# Altium schematic sheet OBPeripheral.SchDoc: ZoM Mod A - OnBoard Peripherals
size A4; Organization: Trenz Electronic GmbH; DocumentNumber: 4; Revision: 01; SheetNumber: 4; SheetTotal: 13; Date: 12/16/2014
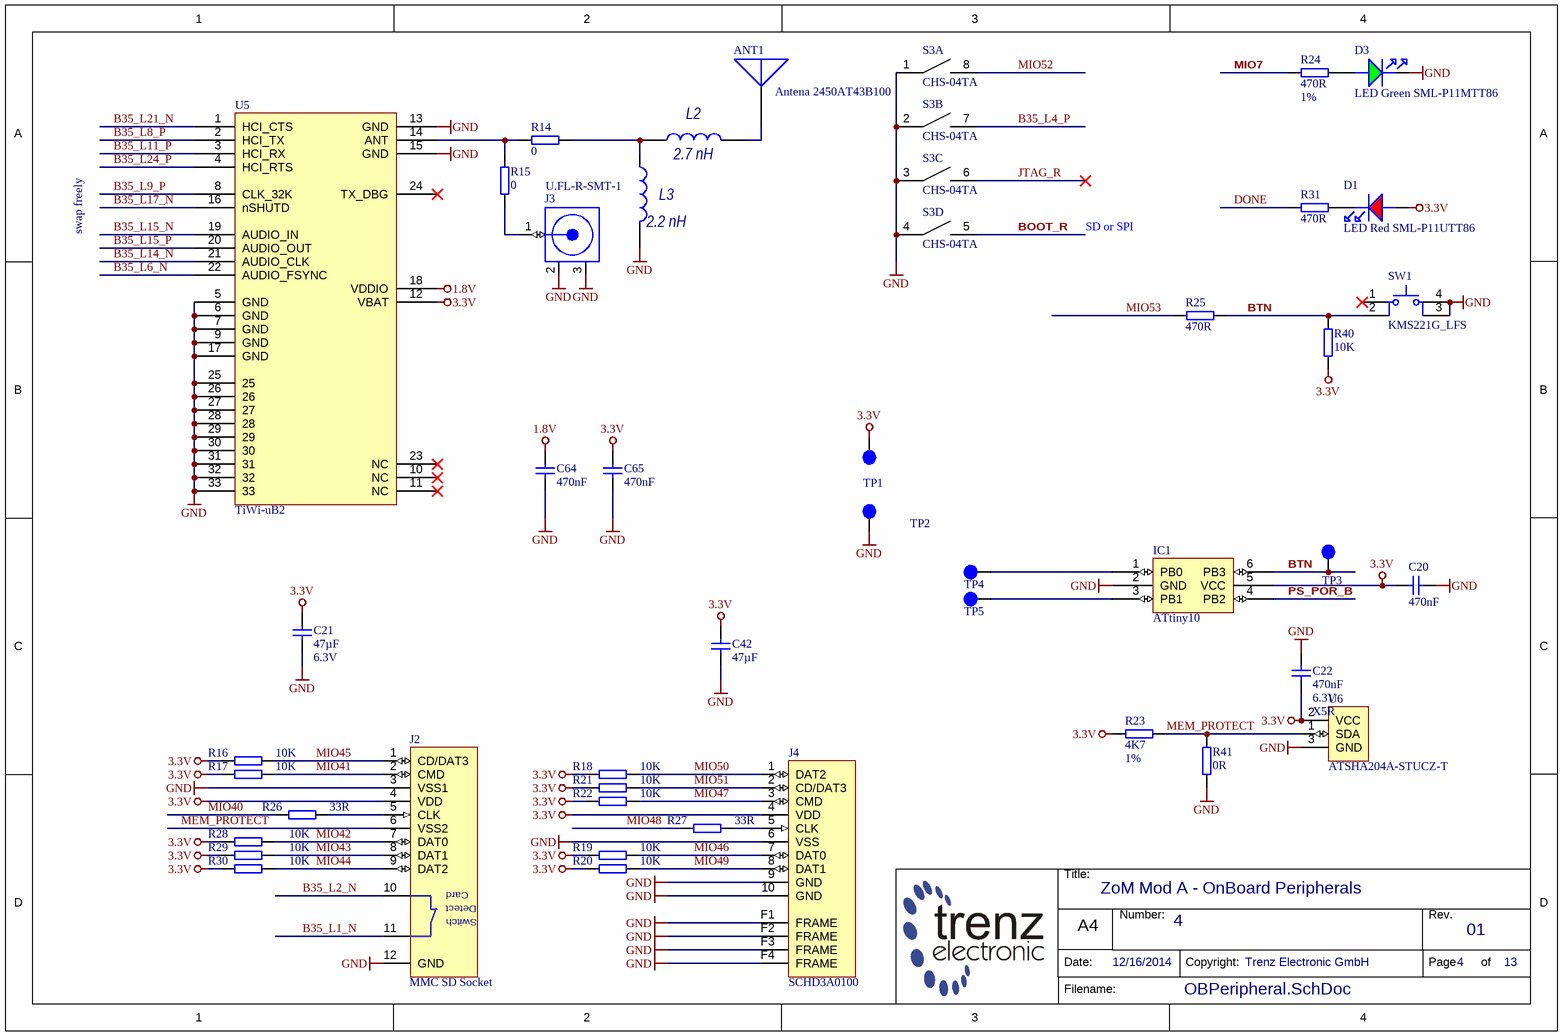
[diagram p0: OBPeripheral.SchDoc]

## Parts
ANT1  Antena 2450AT43B100  [Antena 2450AT43B100]
C20  470nF  [CAPC0603X33N]
C21  47µF  Voltage: 6.3V  [CAPC3216X180N]
C22  470nF  Voltage: 6.3V  Technology: X5R  [CAPC0603X33N]
C42  47µF  [CAPC3216X180N]
C64  470nF  [CAPC0603X33N]
C65  470nF  [CAPC0603X33N]
D1  LED Red SML-P11UTT86  [LEDC1006X25N_RED]
D3  LED Green SML-P11MTT86  [LEDC1006X25N_GREEN]
IC1  value ATtiny10  [SOT23-6]  (hidden comment: Atmel AVR ATtiny10)
J2  MMC SD Socket  [104C-TAA0-R]
J3  U.FL-R-SMT-1  [U.FL-R-SMT-1]
J4  SCHD3A0100  [SCHD3A0100]
L2  US_VisibleSCH: 2.7 nH  [RESC1005X40R]  (hidden comment: IND-Ferrite)
L3  US_VisibleSCH: 2.2 nH  [RESC1005X40R]  (hidden comment: IND-Ferrite)
R14  0  [RESC0603X26N]
R15  0  [RESC0603X26N]
R16  10K  [RESC0603X26N]
R17  10K  [RESC0603X26N]
R18  10K  [RESC0603X26N]
R19  10K  [RESC0603X26N]
R20  10K  [RESC0603X26N]
R21  10K  [RESC0603X26N]
R22  10K  [RESC0603X26N]
R23  4K7  Tolerance: 1%  [RESC0603X26N]
R24  470R  Tolerance: 1%  [RESC1005X40N]
R25  470R  [RESC1005X40N]
R26  33R  [RESC0603X26N]
R27  33R  [RESC0603X26N]
R28  10K  [RESC0603X26N]
R29  10K  [RESC0603X26N]
R30  10K  [RESC0603X26N]
R31  470R  [RESC1005X40N]
R40  10K  [RESC0603X26N]
R41  0R  [RESC1005X40N]
S3  CHS-04TA  [CHS-04TA]  (parts A,B,C,D of 4)
SW1  value KMS221G_LFS  [KMS221G_LFS]  (hidden comment: 4pin button)
TP1  TP  [TP-SMD-2mm]  (value not drawn)  (no BOM)
TP2  TP  [TP-SMD-2mm]  (value not drawn)  (no BOM)
TP3  TP  [TP-SMD-2mm]  (value not drawn)  (no BOM)
TP4  TP  [TP-SMD-2mm]  (value not drawn)  (no BOM)
TP5  TP  [TP-SMD-2mm]  (value not drawn)  (no BOM)
U5  TiWi-uB2  [TiWi-uB2]
U6  ATSHA204A-STUCZ-T  [SOT95P237X112-3N]

## Nets
1.8V: C64.1 U5.18(VDDIO)
3.3V: C20.1 C21.1 C22.2 C42.1 C65.1 D1.A IC1.5(VCC) J2.4(VDD) J4.4(VDD) R16.1 R17.1 R18.1 R19.1 R20.1 R21.1 R22.1 R23.2 R28.1 R29.1 R30.1 R40.2 TP1.1 U5.12(VBAT) U6.2(VCC)
GND: C20.2 C21.2 C22.1 C42.2 C64.2 C65.2 D3.K IC1.2(GND) J2.3(VSS1) J2.12(GND) J3.2(GND) J3.3(GND) J4.6(VSS) J4.9(GND) J4.10(GND) J4.F1(FRAME) J4.F2(FRAME) J4.F3(FRAME) J4.F4(FRAME) L3.2 R41.2 S3.1 S3.2 S3.3 S3.4 SW1.3 SW1.4 TP2.1 U5.5(GND) U5.6(GND) U5.7(GND) U5.9(GND) U5.13(GND) U5.15(GND) U5.17(GND) U5.25 U5.26 U5.27 U5.28 U5.29 U5.30 U5.31 U5.32 U5.33 U6.3(GND)
B35_L1_N: J2.11
B35_L2_N: J2.10
B35_L4_P: S3.7
B35_L6_N: U5.22(AUDIO_FSYNC)
B35_L8_P: U5.2(HCI_TX)
B35_L9_P: U5.8(CLK_32K)
B35_L11_P: U5.3(HCI_RX)
B35_L14_N: U5.21(AUDIO_CLK)
B35_L15_N: U5.19(AUDIO_IN)
B35_L15_P: U5.20(AUDIO_OUT)
B35_L17_N: U5.16(nSHUTD)
B35_L21_N: U5.1(HCI_CTS)
B35_L24_P: U5.4(HCI_RTS)
BOOT_R: S3.5
BTN: IC1.6(PB3) R25.1 R40.1 SW1.2 TP3.1
DONE: R31.2
JTAG_R: S3.6
MEM_PROTECT: J2.6(VSS2) R23.1 R41.1 U6.1(SDA)
MIO7: R24.2
MIO40: R26.1
MIO41: J2.2(CMD) R17.2
MIO42: J2.7(DAT0) R28.2
MIO43: J2.8(DAT1) R29.2
MIO44: J2.9(DAT2) R30.2
MIO45: J2.1(CD/DAT3) R16.2
MIO46: J4.7(DAT0) R19.2
MIO47: J4.3(CMD) R22.2
MIO48: R27.1
MIO49: J4.8(DAT1) R20.2
MIO50: J4.1(DAT2) R18.2
MIO51: J4.2(CD/DAT3) R21.2
MIO52: S3.8
MIO53: R25.2
PS_POR_B: IC1.4(PB2)
NetANT1_1: ANT1.1(Feed_Point) L2.2
NetD1_K: D1.K R31.1
NetD3_A: D3.A R24.1
NetIC1_1: IC1.1(PB0) TP4.1
NetIC1_3: IC1.3(PB1) TP5.1
NetJ2_5: J2.5(CLK) R26.2
NetJ3_1: J3.1(Signal) R15.1
NetJ4_5: J4.5(CLK) R27.2
NetL2_1: L2.1 L3.1 R14.2
NetR14_1: R14.1 R15.2 U5.14(ANT)

Not connected (* = marked no-connect by the designer): SW1 1*; U5 10(NC)* 11(NC)* 23(NC)* 24(TX_DBG)*

## Notes on the sheet
- swap freely
- SD or SPI
- Title:
- Number:
- Rev.
- Date:
- A4
- Copyright:
- Page
- of
- Filename:
- (in symbol 24818) Card; Detect; Switch

## Library data of the parts
C20 C22 C64 C65 = 24921: KON 470nF X5R 6.3V SMD; AN: 24921; Value: 470n; Tolerance: 20%; Mixed: SMT; Preferred: Yes; Case: 0603 (0201)
  C20 C64 C65: Voltage: 6.3V; Technology: X5R
C21 C42 = 24557: KON 47µF 6.3V  X5R SMD 20%; AN: 24557; Mixed: SMT; Value: 47u; Preferred: Yes; Technology: X5R; Case: 3216 (1206); Tolerance: 20%
  C42: Voltage: 6.3V
D1 = 24212: LED Rot SML-P11UTT86 SMD; AN: 24212; Mixed: SMT; Preferred: Yes; Case: 1005 (0402); HelpURL: B:\AD\adlib\datasheet\SML-P1
D3 = 24211: LED Grün SML-P11MTT86 SMD; AN: 24211; Mixed: SMT; Preferred: Yes; Case: 1005 (0402); HelpURL: B:\AD\adlib\datasheet\SML-P1
IC1 = ATtiny10: ID: 9; Component: ATtiny10
J2 = 24818: MCC SD Socket; AN: 24818; Trenz-Stock: Yes; Mixed: SMT; Case: MMC SD; HelpURL: B:\AD\adlib\datasheet\104C-TAA0-R
J3 = 25605: Hirose Ultra Small Coaxial Connector; AN: 25605; Mixed: SMT; HelpURL: B:\AD\adlib\datasheet\U.FL
J4 = 24993: microSD Card (Header Type) SCHD Series; AN: 24993; Trenz-Stock: Yes; Mixed: SMT; Case: microSD; HelpURL: B:\AD\adlib\datasheet\SCHD3A0100
L2 L3 = IND-Ferrite: Ferrite Inductor
R14 R15 = 25021: WID SMD 0; AN: 25021; Mixed: SMT; Value: 33; Preferred: Yes; Case: 0603 (0201); HelpURL: B:\AD\adlib\datasheet\R0201
R16-R22 R28-R30 R40 = 24914: WID SMD 10K 1% 0,05W; AN: 24914; Mixed: SMT; Preferred: Yes; Tolerance: 1%; Case: 0603 (0201); Value: 10K; HelpURL: B:\AD\adlib\datasheet\R0201
R23 = 25242: WID SMD 4K7 1% 0,05W; AN: 25242; Value: 4.7K; Mixed: SMT; Preferred: Yes; Case: 0603 (0201); HelpURL: B:\AD\adlib\datasheet\R0201
R24 R25 R31 = 22769: WID SMD 470R 1% 0,063W; AN: 22769; Value: 470; Mixed: SMT; Preferred: Yes; Case: 1005 (0402)
  R25 R31: Tolerance: 1%
R26 R27 = 25021: WID SMD 33R 1% 0,05W; AN: 25021; Mixed: SMT; Value: 33; Preferred: Yes; Case: 0603 (0201); HelpURL: B:\AD\adlib\datasheet\R0201
R41 = 22738: WID SMD 0R; AN: 22738; Mixed: SMT; Value: 0; Preferred: Yes; Case: 1005 (0402)
S3 = 23417: DIP Schalter 4 fach 1,27mm SMD; AN: 23417; Trenz-Stock: Yes; Mixed: SMT; HelpURL: B:\AD\adlib\datasheet\CHS; Preferred: Yes
SW1 = KMS221G_LFS: ID: 6; Component: RA-SMD-BUTTON; Case: *; FARNELL: *
TP1-TP5 = TP-SMD-2mm: Testpoint; ID: 4; Value: TP-SMD-2mm; Component: TP-SMD-2mm
U6 = 26027: AN: 26027; Mixed: SMT; Trenz-Stock: Yes; Case: SOT23-3; HelpURL: B:\AD\adlib\datasheet\ATSHA204